# EAGLE schematic FieldsPanelWire (EAGLE 9.6.2)
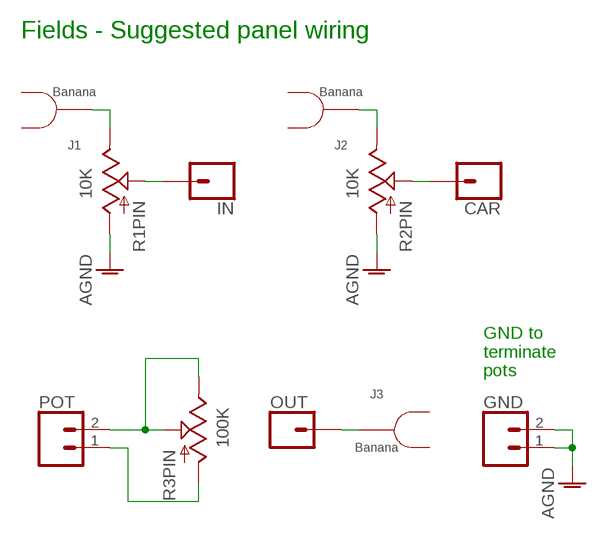
[diagram p0: schematic, sheet 1]

## Parts
CAR  1XWIREPAD  [1X01]
GND  2XWIREPAD  [1X02]
IN  1XWIREPAD  [1X01]
J1  BANANA_SOCKET_PAD  [BANANA_PCB_PAD]
J2  BANANA_SOCKET_PAD  [BANANA_PCB_PAD]
J3  BANANA_SOCKET_PAD  [BANANA_PCB_PAD]
OUT  1XWIREPAD  [1X01]
POT  2XWIREPAD  [1X02]
R1  10K  POTENTIOMETER  [ALPHA_RV09_9MMPOT]
R2  10K  POTENTIOMETER  [ALPHA_RV09_9MMPOT]
R3  100K  POTENTIOMETER  [ALPHA_RV09_9MMPOT]

## Nets
AGND: GND.1 GND.2 R1.C1(PIN:A) R2.C1(PIN:A)
N$1: J1.P$2 R1.C3(PIN:B)
N$2: IN.1 R1.C2(PIN:W)
N$3: J2.P$2 R2.C3(PIN:B)
N$4: CAR.1 R2.C2(PIN:W)
N$5: POT.1 R3.C1(PIN:A)
N$6: POT.2 R3.C2(PIN:W) R3.C3(PIN:B)
N$7: J3.P$2 OUT.1
Unconnected: R1.LUGL R1.LUGR R2.LUGL R2.LUGR R3.LUGL R3.LUGR

## Notes on the sheet
- Fields - Suggested panel wiring
- GND to 
  terminate
  pots

## Library data of the parts
CAR IN OUT = ElectricNoodleBox:1XWIREPAD
GND POT = ElectricNoodleBox:2XWIREPAD
J1-J3 = ElectricNoodleBox:BANANA_SOCKET_PAD
R1-R3 = ElectricNoodleBox:POTENTIOMETER